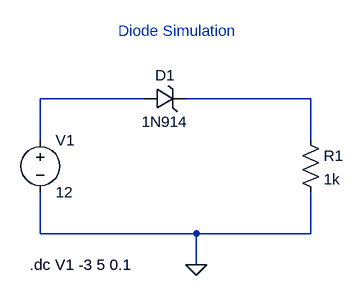
[diagram p0: schematic Diode.asc]
Diode.asc, the LTspice schematic file:
Version 4.1
SHEET 1 880 680
WIRE 224 64 64 64
WIRE 480 64 288 64
WIRE 64 128 64 64
WIRE 480 128 480 64
WIRE 64 272 64 208
WIRE 304 272 64 272
WIRE 480 272 480 208
WIRE 480 272 304 272
WIRE 304 320 304 272
FLAG 304 320 0
SYMBOL voltage 64 112 R0
WINDOW 123 0 0 Left 0
WINDOW 39 0 0 Left 0
SYMATTR InstName V1
SYMATTR Value 12
SYMBOL zener 224 80 R270
WINDOW 0 36 32 VTop 2
WINDOW 3 -4 32 VBottom 2
SYMATTR InstName D1
SYMATTR Value 1N914
SYMBOL res 464 112 R0
SYMATTR InstName R1
SYMATTR Value 1k
TEXT 48 320 Left 2 !.dc V1 -3 5 0.1
TEXT 184 -40 Left 2 ;Diode Simulation

The netlist it stands for:
* Diode.asc
V1 N001 0 12
D1 N001 N002 1N914
R1 N002 0 1k
.model D D
.lib standard.dio
.dc V1 -3 5 0.1
* Diode Simulation
.backanno
.end